# Altium schematic sheet Sheet2_Hierarquia.SchDoc
size A4; SheetNumber: 2; SheetTotal: 3
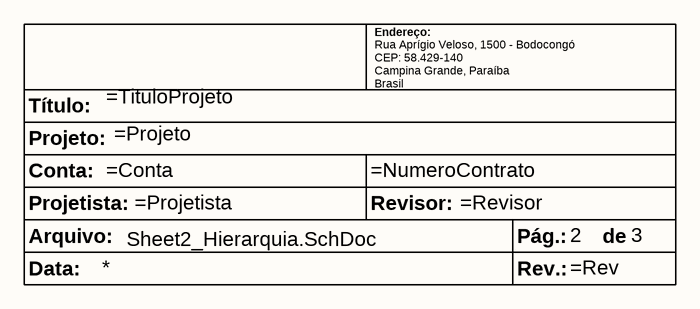
[diagram p0: Sheet2_Hierarquia.SchDoc]

## Parts
TB?  Title Block  (value not drawn)  (graphical)

## Notes on the sheet
- (in symbol Title Block) Type @ to refer to a designator; Endereço:; Título:; Rua Aprígio Veloso, 1500 - Bodocongó / CEP: 58.429-140 / Campina Grande, Paraíba / Brasil; Projeto:; Conta:; Projetista:; Revisor:; Arquivo:; Pág.:; de; Data:; Rev.: